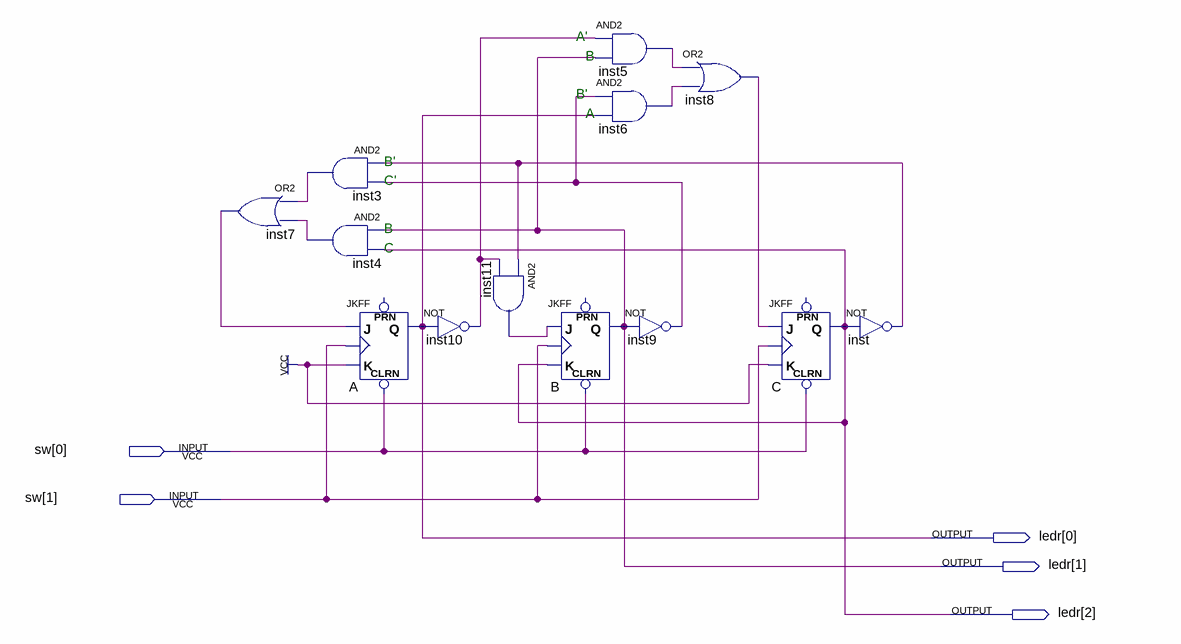
[diagram p0: schematic sheet]
// Quartus schematic mod6.bdf as structural Verilog: 13 symbols, 5 pins
module mod6 (
  input  [1:0] sw,
  output [2:0] ledr
);

  wire inst3_out, inst4_out, inst5_out, inst6_out, inst7_out, inst8_out, inst9_out, inst10_out, inst11_out,
       inst_out;

  or inst7 (inst7_out, inst3_out, inst4_out);
  and inst3 (inst3_out, inst_out, inst9_out);
  and inst4 (inst4_out, ledr[1], ledr[2]);
  JKFF A (.CLRN(sw[0]), .K(1'b1), .J(inst7_out), .CLK(sw[1]), .Q(ledr[0]));  // open: PRN
  and inst11 (inst11_out, inst_out, inst10_out);
  not inst10 (inst10_out, ledr[0]);
  JKFF B (.CLRN(sw[0]), .K(ledr[2]), .J(inst11_out), .CLK(sw[1]), .Q(ledr[1]));  // open: PRN
  and inst5 (inst5_out, inst10_out, ledr[1]);
  and inst6 (inst6_out, inst9_out, ledr[0]);
  not inst9 (inst9_out, ledr[1]);
  or inst8 (inst8_out, inst5_out, inst6_out);
  JKFF C (.CLRN(sw[0]), .K(1'b1), .J(inst8_out), .CLK(sw[1]), .Q(ledr[2]));  // open: PRN
  not inst (inst_out, ledr[2]);

  // Notes on the sheet:
  //   A'
  //   B
  //   B'
  //   A
  //   B'
  //   C'
  //   B
  //   C
endmodule
